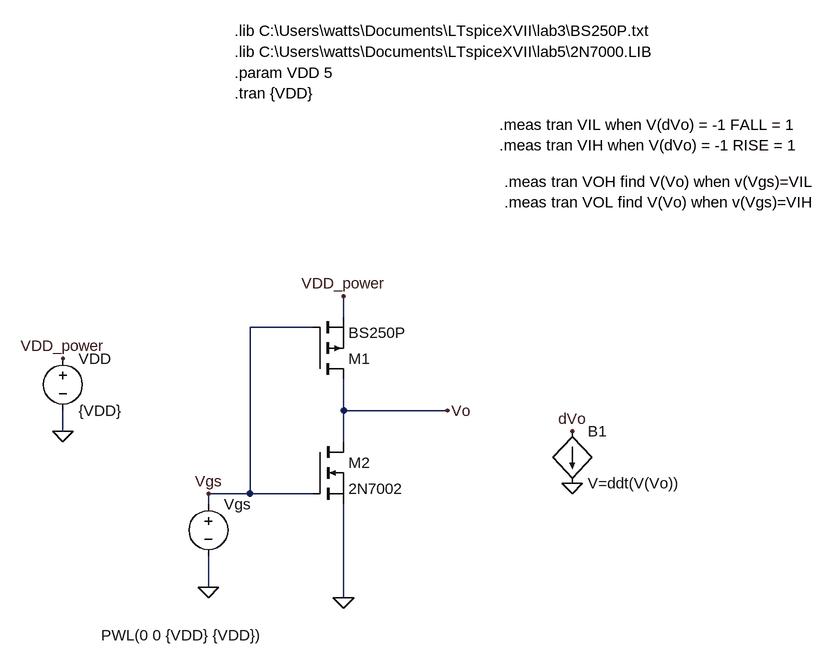
[diagram p0: schematic CMOS_measure.asc]
CMOS_measure.asc, the LTspice schematic file:
Version 4
SHEET 1 1152 680
WIRE 272 -96 272 -128
WIRE 224 -80 128 -80
WIRE 272 48 272 0
WIRE 432 48 272 48
WIRE -160 80 -160 48
WIRE 272 96 272 48
WIRE 128 176 128 -80
WIRE 128 176 64 176
WIRE 224 176 128 176
WIRE 64 192 64 176
WIRE 64 320 64 272
WIRE 272 336 272 192
FLAG 64 320 0
FLAG -160 80 0
FLAG -160 -32 VDD_power
FLAG 272 -128 VDD_power
FLAG 432 48 Vo
FLAG 272 336 0
FLAG 624 160 0
FLAG 624 80 dVo
FLAG 64 176 Vgs
SYMBOL voltage 64 176 R0
WINDOW 123 0 0 Left 0
WINDOW 39 0 0 Left 0
WINDOW 3 -165 218 Left 2
SYMATTR Value PWL(0 0 {VDD} {VDD})
SYMATTR InstName Vgs
SYMBOL voltage -160 -48 R0
SYMATTR InstName VDD
SYMATTR Value {VDD}
SYMBOL bi 624 80 R0
SYMATTR InstName B1
SYMATTR Value V=ddt(V(Vo))
SYMBOL pmos 224 0 M180
SYMATTR InstName M1
SYMATTR Value BS250P
SYMATTR Prefix X
SYMBOL nmos 224 96 R0
SYMATTR InstName M2
SYMATTR Value 2N7002
TEXT 104 -504 Left 2 !.lib C:\\Users\\watts\\Documents\\LTspiceXVII\\lab5\\2N7000.LIB
TEXT 104 -472 Left 2 !.param VDD 5
TEXT 104 -440 Left 2 !.tran {VDD}
TEXT 512 -392 Left 2 !.meas tran VIL when V(dVo) = -1 FALL = 1
TEXT 512 -360 Left 2 !.meas tran VIH when V(dVo) = -1 RISE = 1
TEXT 520 -304 Left 2 !.meas tran VOH find V(Vo) when v(Vgs)=VIL\n.meas tran VOL find V(Vo) when v(Vgs)=VIH
TEXT 104 -536 Left 2 !.lib C:\\Users\\watts\\Documents\\LTspiceXVII\\lab3\\BS250P.txt

The netlist it stands for:
* CMOS_measure.asc
Vgs Vgs 0 PWL(0 0 {VDD} {VDD})
VDD VDD_power 0 {VDD}
B1 dVo 0 V=ddt(V(Vo))
XM1 Vo Vgs VDD_power BS250P  ; pins D G S
M2 Vo Vgs 0 0 2N7002
.model NMOS NMOS
.model PMOS PMOS
.lib standard.mos
.lib C:\Users\watts\Documents\LTspiceXVII\lab5\2N7000.LIB
.param VDD 5
.tran {VDD}
.meas tran VIL when V(dVo) = -1 FALL = 1
.meas tran VIH when V(dVo) = -1 RISE = 1
.meas tran VOH find V(Vo) when v(Vgs)=VIL
.meas tran VOL find V(Vo) when v(Vgs)=VIH
.lib C:\Users\watts\Documents\LTspiceXVII\lab3\BS250P.txt
.backanno
.end